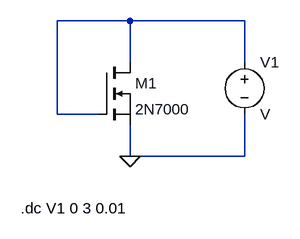
[diagram p0: schematic 1.asc]
1.asc, the LTspice schematic file:
Version 4
SHEET 1 880 680
WIRE 192 96 80 96
WIRE 368 96 192 96
WIRE 192 160 192 96
WIRE 368 160 368 96
WIRE 80 240 80 96
WIRE 144 240 80 240
WIRE 192 304 192 256
WIRE 368 304 368 240
WIRE 368 304 192 304
FLAG 192 304 0
SYMBOL nmos 144 160 R0
SYMATTR InstName M1
SYMATTR Value 2N7000
SYMBOL voltage 368 144 R0
SYMATTR InstName V1
TEXT 24 384 Left 2 !.dc V1 0 3 0.01

The netlist it stands for:
* 1.asc
M1 N001 N001 0 0 2N7000
V1 N001 0 V
.model NMOS NMOS
.model PMOS PMOS
.lib standard.mos
.dc V1 0 3 0.01
.backanno
.end